# EAGLE design pwr (EAGLE 8.2.2)
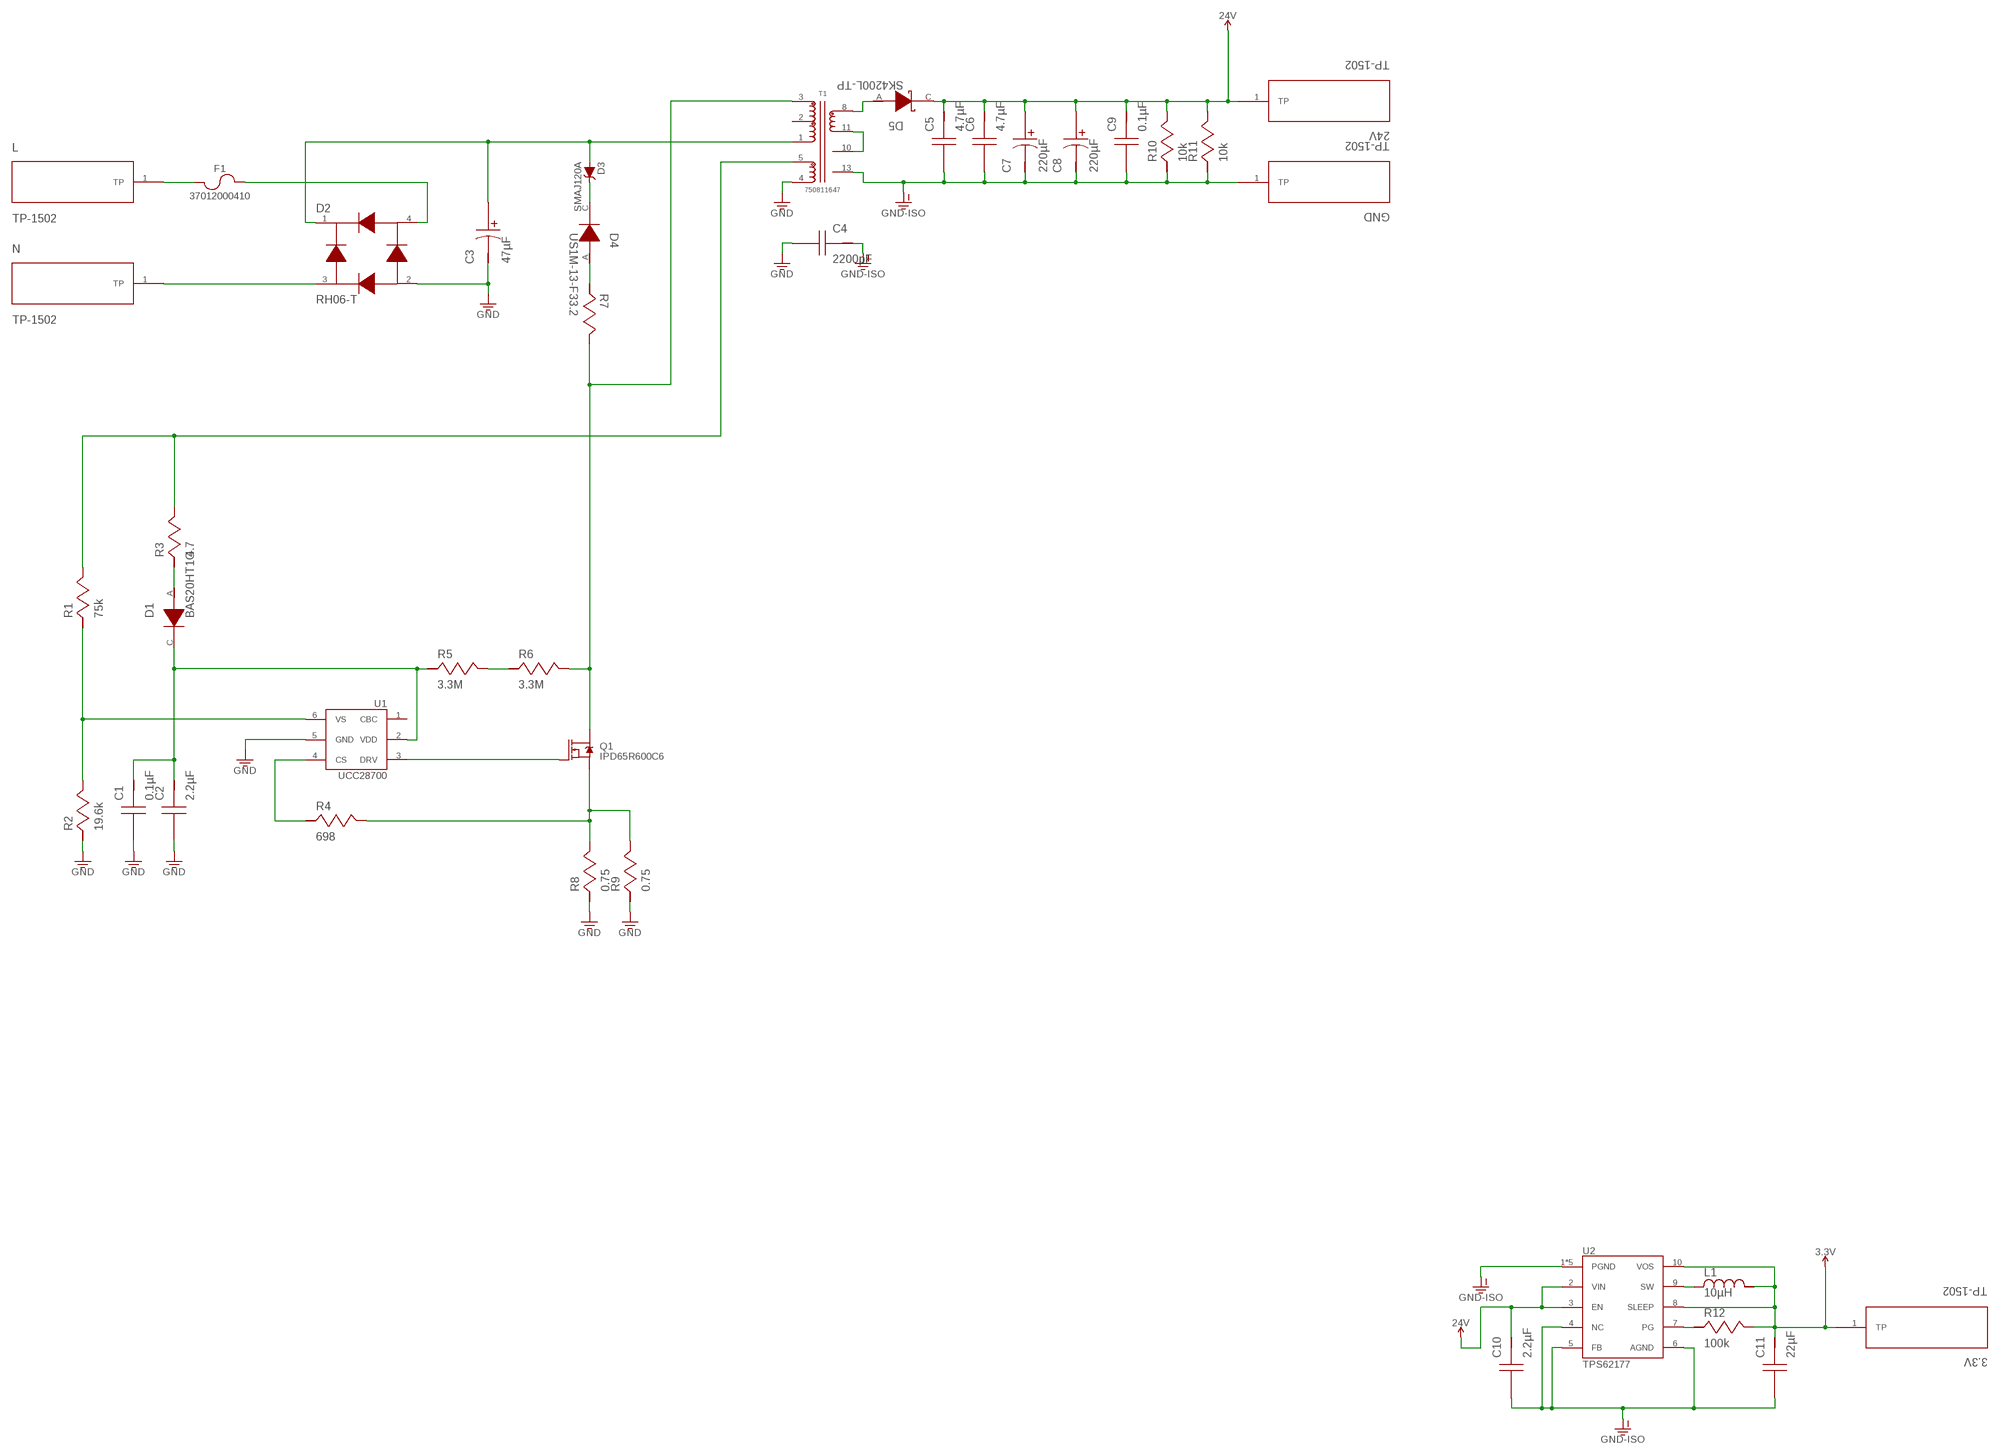
[diagram p0: schematic, sheet 1]

## Parts
3.3V  TP-1502  [TP-1502]
24V  TP-1502  [TP-1502]
C1  0.1µF  06035C104KAT2A  [0603]
C2  2.2µF  GRM31CR61H225KA88L  [1206]
C3  47µF  EEU-ED2G470S  [CAPPR7.5-18X20]
C4  2200pF  DE1E3KX222MA4BN01F  [DE1E3KX222MA4BL01]
C5  4.7µF  UMK316AB7475KL-T  [1206]
C6  4.7µF  UMK316AB7475KL-T  [1206]
C7  220µF  UHE1V221MPD6  [CAPPR5-10X16]
C8  220µF  UHE1V221MPD6  [CAPPR5-10X16]
C9  0.1µF  08053C104KAT2A  [0805]
C10  2.2µF  C1608X5R1V225K080AC  [0603]
C11  22µF  GRM21BR60J226ME39L  [0805]
D1  BAS20HT1G  [SOD-323]
D2  RH06-T  [MINIDIP]
D3  SMAJ120A  [SMA]
D4  US1M-13-F  [SMA]
D5  SK4200L-TP  [SMC]
F1  37012000410  [TR5_FUSE_8.5]
GND  TP-1502  [TP-1502]
L  TP-1502  [TP-1502]
L1  10µH  SDR0503-100ML  [SDR0503]
N  TP-1502  [TP-1502]
Q1  IPD65R600C6  [TO-252]
R1  75k  CRCW060375K0FKEA  [0603]
R2  19.6k  CRCW060319K6FKEA  [0603]
R3  4.7  CRCW12064R70JNEA  [1206]
R4  698  CRCW1206698RFKEA  [1206]
R5  3.3M  CRCW08053M30JNEA  [0805]
R6  3.3M  CRCW08053M30JNEA  [0805]
R7  33.2  CRCW121033R2FKEA  [1210]
R8  0.75  CSR1206FKR750  [1206]
R9  0.75  CSR1206FKR750  [1206]
R10  10k  CRCW120610K0JNEA  [1206]
R11  10k  CRCW120610K0JNEA  [1206]
R12  100k  CRCW0402100KFKED  [0402]
T1  750811647  [750811647]
U1  UCC28700  [SOT-23(6)]
U2  TPS62177  [P-WSON(10)]

## Nets
3.3V: 3.3V.1(TP) C11.1 L1.2 R12.1 U2.8(SLEEP) U2.10(VOS)
24V: 24V.1(TP) C5.1 C6.1 C7.P$1 C8.P$1 C9.1 C10.1 D5.C R10.1 R11.1 U2.2(VIN) U2.3(EN)
GND: C1.2 C2.2 C3.P$2 C4.2 D2.2 R2.2 R8.2 R9.2 T1.4 U1.5(GND)
GND-ISO: C4.1 C5.2 C6.2 C7.P$2 C8.P$2 C9.2 C10.2 C11.2 GND.1(TP) R10.2 R11.2 T1.13 U2.1(PGND) U2.4(NC) U2.5(FB) U2.6(AGND) U2.GND U2.P$1(PGND) U2.P$2(PGND) U2.P$10(PGND)
N$1: D2.4 F1.2
N$2: D2.3 N.1(TP)
N$3: C3.P$1 D2.1 D3.A T1.1
N$4: R12.2 U2.7(PG)
N$5: L1.1 U2.9(SW)
N$6: D5.A T1.8
N$7: T1.10 T1.11
N$8: D3.C D4.C
N$9: D4.A R7.2
N$10: Q1.2(D) R6.1 R7.1 T1.3
N$11: F1.1 L.1(TP)
N$13: Q1.1(G) U1.3(DRV)
N$14: C1.1 C2.1 D1.C R5.2 U1.2(VDD)
N$15: Q1.3(S) R4.1 R8.1 R9.1
N$16: D1.A R3.2
N$17: R1.1 R3.1 T1.5
N$18: R4.2 U1.4(CS)
N$19: R5.1 R6.2
N$20: R1.2 R2.1 U1.6(VS)
Unconnected: T1.2 U1.1(CBC)

## Library data of the parts
3.3V 24V GND L N = derek:TP-1502
C1 = derek:06035C104KAT2A; DATASHEET_URL: http://datasheets.avx.com/X7RDielectric.pdf; DIGIKEY_PART_NUMBER: 478-5052-1-ND; MANUFACTURER: AVX Corporation; PART_NUMBER: 06035C104KAT2A
C2 = derek:GRM31CR61H225KA88L; DATASHEET_URL: http://www.murata.com/~/media/webrenewal/support/library/catalog/products/capacitor/mlcc/c02e.ashx; DIGIKEY_PART_NUMBER: 490-6514-1-ND; MANUFACTURER: Murata Electronics North America; PART_NUMBER: GRM31CR61H225KA88L
C3 = derek:EEU-ED2G470S; DATASHEET_URL: https://industrial.panasonic.com/cdbs/www-data/pdf/RDF0000/ABA0000C1258.pdf; DIGIKEY_PART_NUMBER: P13546-ND; MANUFACTURER: Panasonic Electronic Components; PART_NUMBER: EEU-ED2G470S
C4 = derek:DE1E3KX222MA4BN01F; DATASHEET_URL: http://www.murata.com/~/media/webrenewal/support/library/catalog/products/capacitor/mlcc/c85e.ashx; DIGIKEY_PART_NUMBER: 490-9384-ND; MANUFACTURER: Murata Electronics North America; PART_NUMBER: DE1E3KX222MA4BN01F
C5 C6 = derek:UMK316AB7475KL-T; DATASHEET_URL: http://www.yuden.co.jp/productdata/catalog/en/mlcc_all_e.pdf; DIGIKEY_PART_NUMBER: 587-2994-1-ND; MANUFACTURER: Taiyo Yuden; PART_NUMBER: UMK316AB7475KL-T
C7 C8 = derek:UHE1V221MPD6; DATASHEET_URL: http://nichicon-us.com/english/products/pdfs/e-uhe.pdf; DIGIKEY_PART_NUMBER: 493-14552-1-ND; MANUFACTURER: Nichicon; PART_NUMBER: UHE1V221MPD6
C9 = derek:08053C104KAT2A; DATASHEET_URL: http://datasheets.avx.com/X7RDielectric.pdf; DIGIKEY_PART_NUMBER: 478-3755-1-ND; MANUFACTURER: AVX Corporation; PART_NUMBER: 08053C104KAT2A
C10 = derek:C1608X5R1V225K080AC; DATASHEET_URL: https://product.tdk.com/info/en/catalog/datasheets/mlcc_commercial_general_en.pdf; DIGIKEY_PART_NUMBER: 445-8025-1-ND; MANUFACTURER: TDK Corporation; PART_NUMBER: C1608X5R1V225K080AC
C11 = derek:GRM21BR60J226ME39L; DATASHEET_URL: http://www.murata.com/~/media/webrenewal/support/library/catalog/products/capacitor/mlcc/c02e.ashx; DIGIKEY_PART_NUMBER: 490-1719-1-ND; MANUFACTURER: Murata Electronics North America; PART_NUMBER: GRM21BR60J226ME39L
D1 = derek:BAS20HT1G; DATASHEET_URL: http://www.onsemi.com/pub_link/Collateral/BAS20HT1-D.PDF; DIGIKEY_PART_NUMBER: BAS20HT1GOSCT-ND; MANUFACTURER: ON Semiconductor; PART_NUMBER: BAS20HT1G
D2 = derek:RH06-T; DATASHEET_URL: https://www.diodes.com/assets/Datasheets/ds30137.pdf; DIGIKEY_PART_NUMBER: RH06DICT-ND; MANUFACTURER: Diodes Incorporated; PART_NUMBER: RH06-T
D3 = derek:SMAJ120A; DATASHEET_URL: http://www.littelfuse.com/~/media/electronics/datasheets/tvs_diodes/littelfuse_tvs_diode_smaj_datasheet.pdf.pdf; DIGIKEY_PART_NUMBER: SMAJ120ALFCT-ND; MANUFACTURER: Littelfuse Inc.; PART_NUMBER: SMAJ120A
D4 = derek:US1M-13-F; DATASHEET_URL: https://www.diodes.com/assets/Datasheets/ds16008.pdf; DIGIKEY_PART_NUMBER: US1M-FDICT-ND; MANUFACTURER: Diodes Incorporated; PART_NUMBER: US1M-13-F
D5 = derek:SK4200L-TP; DATASHEET_URL: http://www.mccsemi.com/up_pdf/SK4200L(SMC).pdf; DIGIKEY_PART_NUMBER: SK4200L-TPMSCT-ND; MANUFACTURER: Micro Commercial Co; PART_NUMBER: SK4200L-TP
F1 = derek:37012000410; DATASHEET_URL: http://www.littelfuse.com/~/media/electronics/datasheets/fuses/littelfuse_fuse_370_datasheet.pdf.pdf; DIGIKEY_PART_NUMBER: WK4957BK-ND; MANUFACTURER: Littelfuse Inc.; PART_NUMBER: 37012000410
L1 = derek:SDR0503-100ML; DATASHEET_URL: http://www.bourns.com/docs/Product-Datasheets/SDR0503.pdf; DIGIKEY_PART_NUMBER: SDR0503-100MLCT-ND; MANUFACTURER: Bourns Inc.; PART_NUMBER: SDR0503-100ML
Q1 = derek:IPD65R600C6; DATASHEET_URL: http://www.infineon.com/dgdl/Infineon-IPD65R600C6-DS-v02_01-en.pdf?folderId=5546d4694909da4801490a07012f053b&fileId=db3a30433f1b26e8013f2ceafdee37c4; DIGIKEY_PART_NUMBER: IPD65R600C6BTMA1CT-ND; MANUFACTURER: Infineon Technologies; PART_NUMBER: IPD65R600C6
R1 = derek:CRCW060375K0FKEA; DATASHEET_URL: http://www.vishay.com/docs/20035/dcrcwe3.pdf; DIGIKEY_PART_NUMBER: 541-75.0KHCT-ND; MANUFACTURER: Vishay Dale; PART_NUMBER: CRCW060375K0FKEA
R2 = derek:CRCW060319K6FKEA; DATASHEET_URL: http://www.vishay.com/docs/20035/dcrcwe3.pdf; DIGIKEY_PART_NUMBER: 541-19.6KHCT-ND; MANUFACTURER: Vishay Dale; PART_NUMBER: CRCW060319K6FKEA
R3 = derek:CRCW12064R70JNEA; DATASHEET_URL: http://www.vishay.com/docs/20035/dcrcwe3.pdf; DIGIKEY_PART_NUMBER: 541-4.7ECT-ND; MANUFACTURER: Vishay Dale; PART_NUMBER: CRCW12064R70JNEA
R4 = derek:CRCW1206698RFKEA; DATASHEET_URL: http://www.vishay.com/docs/20035/dcrcwe3.pdf; DIGIKEY_PART_NUMBER: 541-698FCT-ND; MANUFACTURER: Vishay Dale; PART_NUMBER: CRCW1206698RFKEA
R5 R6 = derek:CRCW08053M30JNEA; DATASHEET_URL: http://www.vishay.com/docs/20035/dcrcwe3.pdf; DIGIKEY_PART_NUMBER: 541-3.3MACT-ND; MANUFACTURER: Vishay Dale; PART_NUMBER: CRCW08053M30JNEA
R7 = derek:CRCW121033R2FKEA; DATASHEET_URL: http://www.vishay.com/docs/20043/crcwhpe3.pdf; DIGIKEY_PART_NUMBER: 541-33.2AACT-ND; MANUFACTURER: Vishay Dale; PART_NUMBER: CRCW121033R2FKEA
R8 R9 = derek:CSR1206FKR750; DATASHEET_URL: https://www.seielect.com/Catalog/SEI-CSR_CSRN.pdf; DIGIKEY_PART_NUMBER: CSR1206FKR750CT-ND; MANUFACTURER: Stackpole Electronics Inc.; PART_NUMBER: CSR1206FKR750
R10 R11 = derek:CRCW120610K0JNEA; DATASHEET_URL: http://www.vishay.com/docs/20035/dcrcwe3.pdf; DIGIKEY_PART_NUMBER: 541-10KECT-ND; MANUFACTURER: Vishay Dale; PART_NUMBER: CRCW120610K0JNEA
R12 = derek:CRCW0402100KFKED; DATASHEET_URL: http://www.vishay.com/docs/20035/dcrcwe3.pdf; DIGIKEY_PART_NUMBER: 541-100KLCT-ND; MANUFACTURER: Vishay Dale; PART_NUMBER: CRCW0402100KFKED
T1 = derek:750811647; DATASHEET_URL: https://katalog.we-online.com/ctm/datasheet/750811647.pdf; MANUFACTURER: Wurth Electronics Midcom; PART_NUMBER: 750811647
U1 = derek:UCC28700; DATASHEET_URL: http://www.ti.com/lit/ds/symlink/ucc28700.pdf; DIGIKEY_PART_NUMBER: 296-39536-1-ND; MANUFACTURER: Texas Instruments; PART_NUMBER: UCC28700DBVR
U2 = derek:TPS62177; DATASHEET_URL: http://www.ti.com/lit/ds/symlink/tps62177.pdf; DIGIKEY_PART_NUMBER: 296-41856-1-ND; MANUFACTURER: Texas Instruments; PART_NUMBER: TPS62177DQCR

## Board
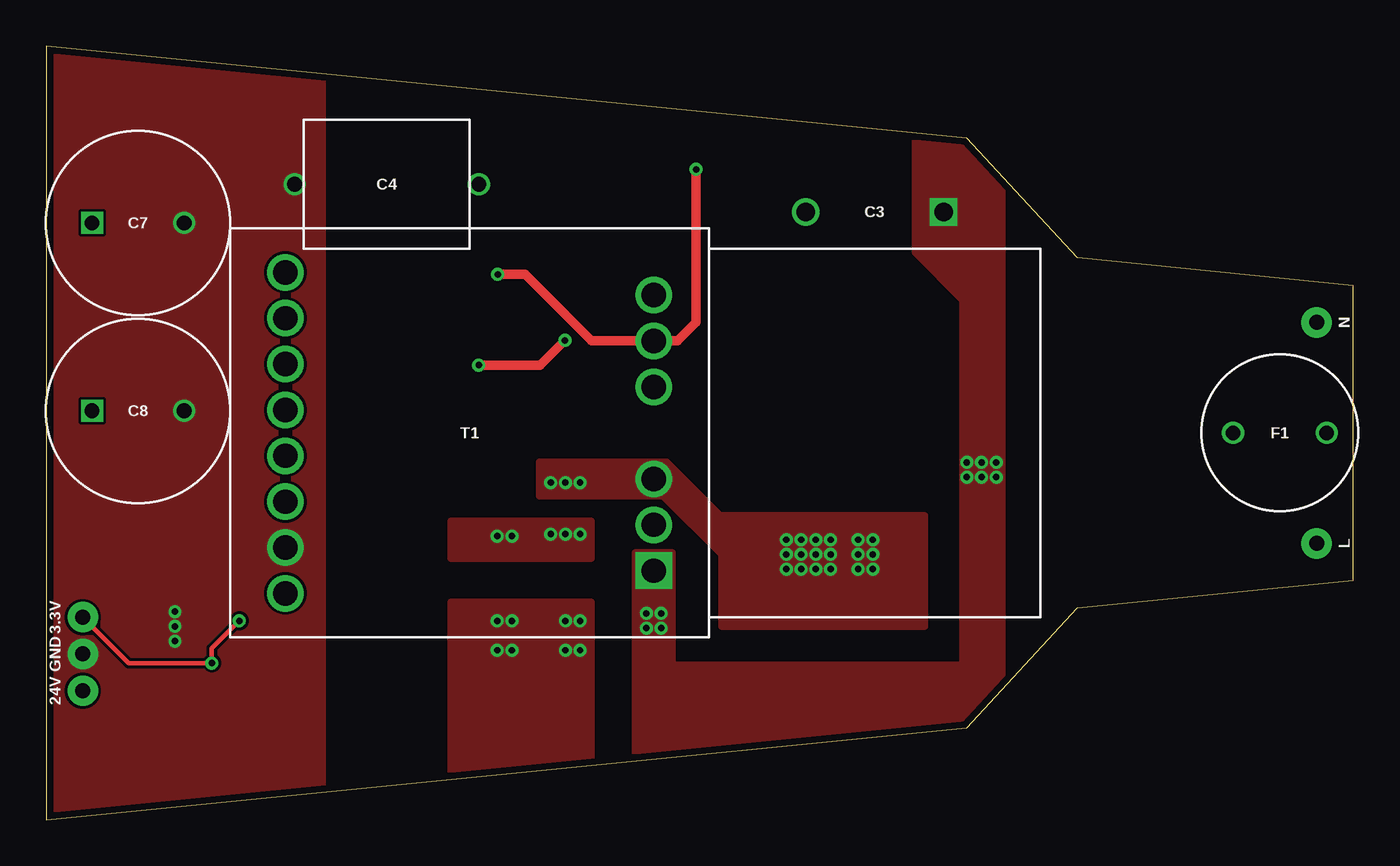
[diagram p1: board, top side]
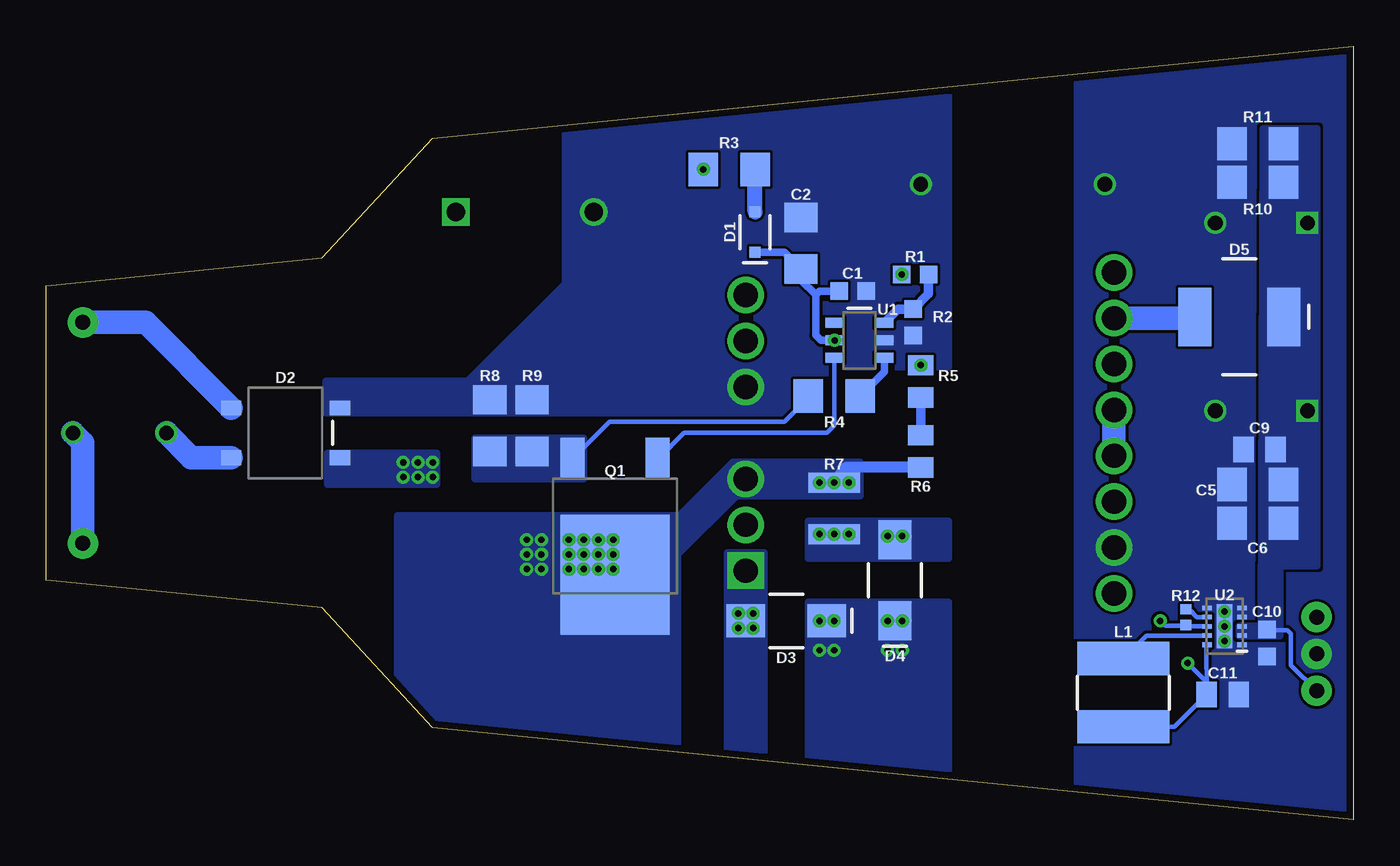
[diagram p2: board, bottom side, seen from below]

Size 71 x 42 mm. Coordinates in mm from the lower left corner, seen from the top.
Outline: 0,0 50,5 56,11.5 71,13 71,29 56,30.5 50,37 0,42 0,0
Copper layers (1*16): Top 0.0356mm / dielectric 1.5011mm / Bottom 0.0356mm
Design rules "LaenPCBOrder *": minimum track width 6mil, minimum drill 13mil, track to track 6mil, track to pad 6mil, pad to pad 6mil, via to via 6mil, smd to smd 6mil, copper to edge 15mil, drill to drill 6mil, minimum pad ring 7mil, minimum via ring 7mil, stop-mask expansion 3mil, vias tented up to drill 100mil, thermal gap 10mil

### Footprints (pad centres in the part's own frame; a part is rotated, then mirrored left to right if it is on the bottom)
TP-1502 = drill 0.813 pad 1.651: 1 0,0
0603 = smd 0.95 x 0.95: 1 -0.725,0; 2 0.725,0
1206 = smd 1.6 x 1.8: 1 -1.4,0; 2 1.4,0
CAPPR7.5-18X20 = drill 1 square: P$1 -3.75,0 | drill 1: P$2 3.75,0
DE1E3KX222MA4BL01 = drill 0.8: 1 -5,0; 2 5,0
CAPPR5-10X16 = drill 0.8 square: P$1 -2.5,0 | drill 0.8: P$2 2.5,0
0805 = smd 1.1 x 1.4: 1 -0.875,0; 2 0.875,0
SOD-323 = smd 0.6 x 0.6: A 1.1,0; C -1.1,0
MINIDIP = smd 0.8 x 1.1: 1 -1.35,-2.95; 2 1.35,-2.95; 3 1.35,2.95; 4 -1.35,2.95
SMA = smd 2.1 x 1.8: A 2.2,0; C -2.2,0
SMC = smd 1.778 x 3.175: A 2.413,0; C -2.413,0
TR5_FUSE_8.5 = drill 0.8: 1 -2.54,0; 2 2.54,0
SDR0503 = smd 1.8 x 5: 1 -1.85,0; 2 1.85,0
TO-252 = smd 1.3 x 2.3: 1 -2.3,-4.2; 3 2.3,-4.2 | smd 5.9 x 6.5: 2 0,2.1
1210 = smd 1.1 x 2.8: 1 -1.4,0; 2 1.4,0
0402 = smd 0.55 x 0.6: 1 -0.425,0; 2 0.425,0
750811647 = drill 1.32 square: 1 -7.48,-10 | drill 1.32: 2 -4.99,-10; 3 -2.5,-10; 4 2.5,-10; 5 4.99,-10; 6 7.48,-10; 7 8.715,10; 8 6.225,10; 9 3.735,10; 10 1.245,10; 11 -1.245,10; 12 -3.735,10; 13 -6.225,10; 14 -8.715,10
SOT-23(6) = smd 0.55 x 1: 1 -0.95,-1.35; 2 0,-1.35; 3 0.95,-1.35; 4 0.95,1.35; 5 0,1.35; 6 -0.95,1.35
P-WSON(10) = smd 0.25 x 0.5: 1 -1,-0.95; 2 -0.5,-0.95; 3 0,-0.95; 4 0.5,-0.95; 5 1,-0.95; 6 1,0.95; 7 0.5,0.95; 8 0,0.95; 9 -0.5,0.95; 10 -1,0.95 | smd 2.4 x 0.84: GND 0,0 | drill 0.35: P$1 0.8,0; P$2 -0.8,0; P$10 0,0

### Placement (x,y rotation side)
3.3V  2,11 90 top
24V  2,7 90 top
C1  27.2,28.7 0 bottom
C2  30,31.3 90 bottom
C3  45,33 180 top
C4  18.5,34.5 0 top
C5  5.2,18.2 180 bottom
C6  5.2,16.1 180 bottom
C7  5,32.4 0 top
C8  5,22.2 0 top
C9  5.1,20.1 180 bottom
C10  4.7,9.6 270 bottom
C11  7.1,6.8 0 bottom
D1  32.5,31.9 90 bottom
D2  58,21 90 bottom
D3  30.8,10.8 180 bottom
D4  24.9,13 90 bottom
D5  6.2,27.3 180 bottom
F1  67,21 180 top
GND  2,9 90 top
L  69,15 270 top
L1  12.5,6.9 270 bottom
N  69,27 270 top
Q1  40.1,15.4 180 bottom
R1  23.8,29.6 0 bottom
R2  23.9,27 270 bottom
R3  33.9,35.3 0 bottom
R4  28.2,23 0 bottom
R5  23.5,23.8 90 bottom
R6  23.5,20 90 bottom
R7  28.2,16.9 270 bottom
R8  46.9,21.4 90 bottom
R9  44.6,21.4 90 bottom
R10  5.2,34.6 180 bottom
R11  5.2,36.7 180 bottom
R12  9.1,11 90 bottom
T1  23,21 90 top
U1  26.83,26.02 270 bottom
U2  7,10.5 90 bottom

### Tracks (layer width: path | path; a pad name or v marks a point on that pad's centre or on a via)
3.3V  (via drill 0.35)
  Top 0.254: v10.5,10.8 9,9.3 v9,8.5 4.5,8.5 3.3V.1
  Bottom 0.254: C11.1 8,9.47 U2.10 | C11.1 8,7.5 v9,8.5 | v10.5,10.8 10.23,10.53 9.05,10.53 R12.1 9.03,10.5 U2.8 | C11.1 9.72,5.05 L1.2
24V
  Bottom 0.254: 24V.1 3.4,8.4 3.4,10.1 3.6,10.3 4.67,10.3 C10.1
  pour Bottom (no thermals): 4,10 6.2,10 6.2,10.5 5,10.5 4.9,37.5 2,37.5 2,13.8 4,13.8
GND
  pour Bottom (no thermals): 55.8,23.8 48.1,23.8 42.8,29.1 42.8,42 22,42 22,24.6 28.7,24.6 28.7,22.1 55.8,22.1
GND-ISO
  pour Bottom (rank 2, no thermals): 15,0 15,42 0,42 0,0
  pour Top (no thermals): 15,0 0,0 0,42 15,42
N$1
  Bottom 1.27: D2.4 63.11,19.65 F1.2
N$2
  Bottom 1.27: N.1 65.6,27 D2.3
N$3  (via drill 0.35)
  other vias: 33.4,10.4 32.6,10.4 32.6,11.2 33.4,11.2 50,19.4 50.8,19.4 50,18.6 51.6,18.6 51.6,19.4 50.8,18.6
  pour Bottom (no thermals): 34,14.5 34,0 32,0 32,14.5
  pour Top (no thermals): 47.2,42 47.2,30.8 49.8,28.2 49.8,8.4 34,8.4 34,14.5 32,14.5 32,0 51.9,0 51.9,42
  pour Bottom (no thermals): 55.7,19.9 49.8,19.9 49.8,18.2 55.7,18.2
N$4
  Bottom 0.254: U2.7 8.5,11 8.93,11.43 R12.2
N$5
  Bottom 0.254: U2.9 11.25,10 L1.1
N$6
  Bottom 1.27: T1.8 8.69,27.23 D5.A
N$7
  Bottom 1.27: T1.10 T1.11
N$8  (via drill 0.35)
  other vias: 29,9.2 28.2,9.2 29,10.8 28.2,10.8 25.3,10.8 24.5,10.8 25.3,9.2 24.5,9.2
  pour Bottom (no thermals): 29.6,11.8 29.6,0 22,0 22,11.8
  pour Top (no thermals): 29.6,0 22,0 22,11.8 29.6,11.8
N$9  (via drill 0.35)
  other vias: 28.2,15.5 29,15.5 27.4,15.5 25.3,15.4 24.5,15.4
  pour Bottom (no thermals): 22,14.2 22,16.2 29.6,16.2 29.6,14.2
  pour Top (no thermals): 29.6,14.2 22,14.2 22,16.2 29.6,16.2
N$10  (via drill 0.35)
  Bottom 0.61: R6.1 27.57,19.12 R7.1
  other vias: 44.9,13.6 44.9,14.4 44.9,15.2 44.1,15.2 44.1,14.4 44.1,13.6 42.6,13.6 42.6,14.4 42.6,15.2 41.8,15.2 41,15.2 40.2,15.2 40.2,14.4 41,14.4 41.8,14.4 41.8,13.6 41,13.6 40.2,13.6 29,18.3 28.2,18.3 27.4,18.3
  pour Bottom (no thermals): 51.9,0 51.9,16.5 36.6,16.5 33.7,19.4 26.8,19.4 26.8,17.6 33.5,17.6 36.7,14.4 36.7,0
  pour Top (no thermals): 26.8,17.6 33.5,17.6 36.7,14.4 36.7,10.5 47.7,10.5 47.7,16.5 36.6,16.5 33.7,19.4 26.8,19.4
N$11
  Bottom 1.27: L.1 69,20.46 F1.1
N$13
  Bottom 0.254: U1.3 28.18,21.42 28.6,21 36.35,21 37.77,19.57 Q1.1
N$14  (via drill 0.35)
  Top 0.508: R5.2 26.84,24.68 U1.2
  Bottom 0.406: 29.2,28.5 29.2,26.3 28.92,26.02 U1.2 | 29.2,28.5 29,28.7 C1.1 | 29.2,28.5 30,29.3 C2.1 30.9,30.8 D1.C
  other vias: 23.5,24.68 28.18,26.02
N$15
  Bottom 0.254: R4.1 29.6,22.9 30.9,21.6 40.4,21.6 Q1.3
  pour Bottom (no thermals): 41.8,20.7 41.8,18.5 47.7,18.5 47.7,20.7
N$16
  Bottom 0.813: D1.A R3.2
N$17  (via drill 0.35)
  Top 0.508: v24.52,29.6 26,29.6 29.61,25.99 T1.5 34.29,25.99 35.3,27 R3.1
  other vias: 35.3,35.3
N$18
  Bottom 0.406: U1.4 25.48,24.32 R4.2
N$19
  Bottom 0.508: R6.2 R5.1
N$20
  Bottom 0.508: U1.6 24.73,27.73 R2.1 23.07,28.55 R1.2